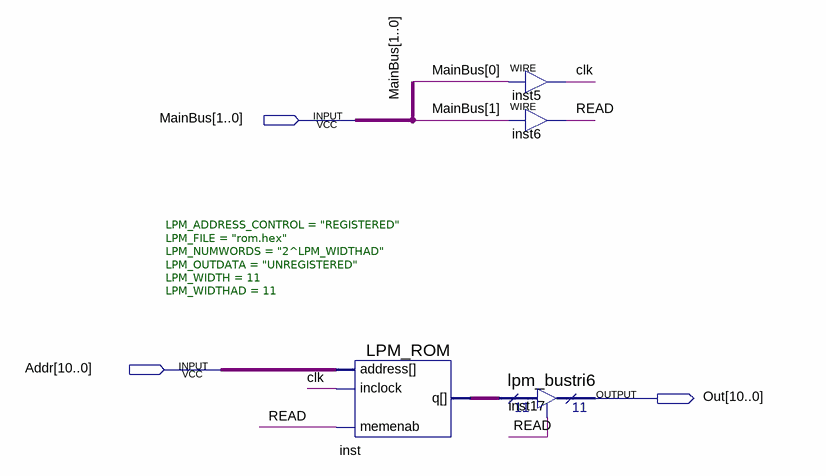
[diagram p0: schematic sheet]
// Quartus schematic ROMMemory.bdf as structural Verilog: 4 symbols, 3 pins
module ROMMemory (
  input  [1:0] MainBus,
  input  [10:0] Addr,
  output [10:0] Out
);

  wire clk, READ;
  wire [10:0] inst_q;

  LPM_ROM #(.LPM_ADDRESS_CONTROL("REGISTERED"), .LPM_FILE("rom.hex"), .LPM_NUMWORDS("2^LPM_WIDTHAD"), .LPM_OUTDATA("UNREGISTERED"), .LPM_WIDTH(11), .LPM_WIDTHAD(11)) inst (
    .address(Addr), .inclock(clk), .memenab(READ), .q(inst_q));
  assign clk = MainBus[0];  // WIRE inst5
  assign READ = MainBus[1];  // WIRE inst6
  lpm_bustri6 inst17 (.enabledt(READ), .data(inst_q), .tridata(Out));
endmodule
